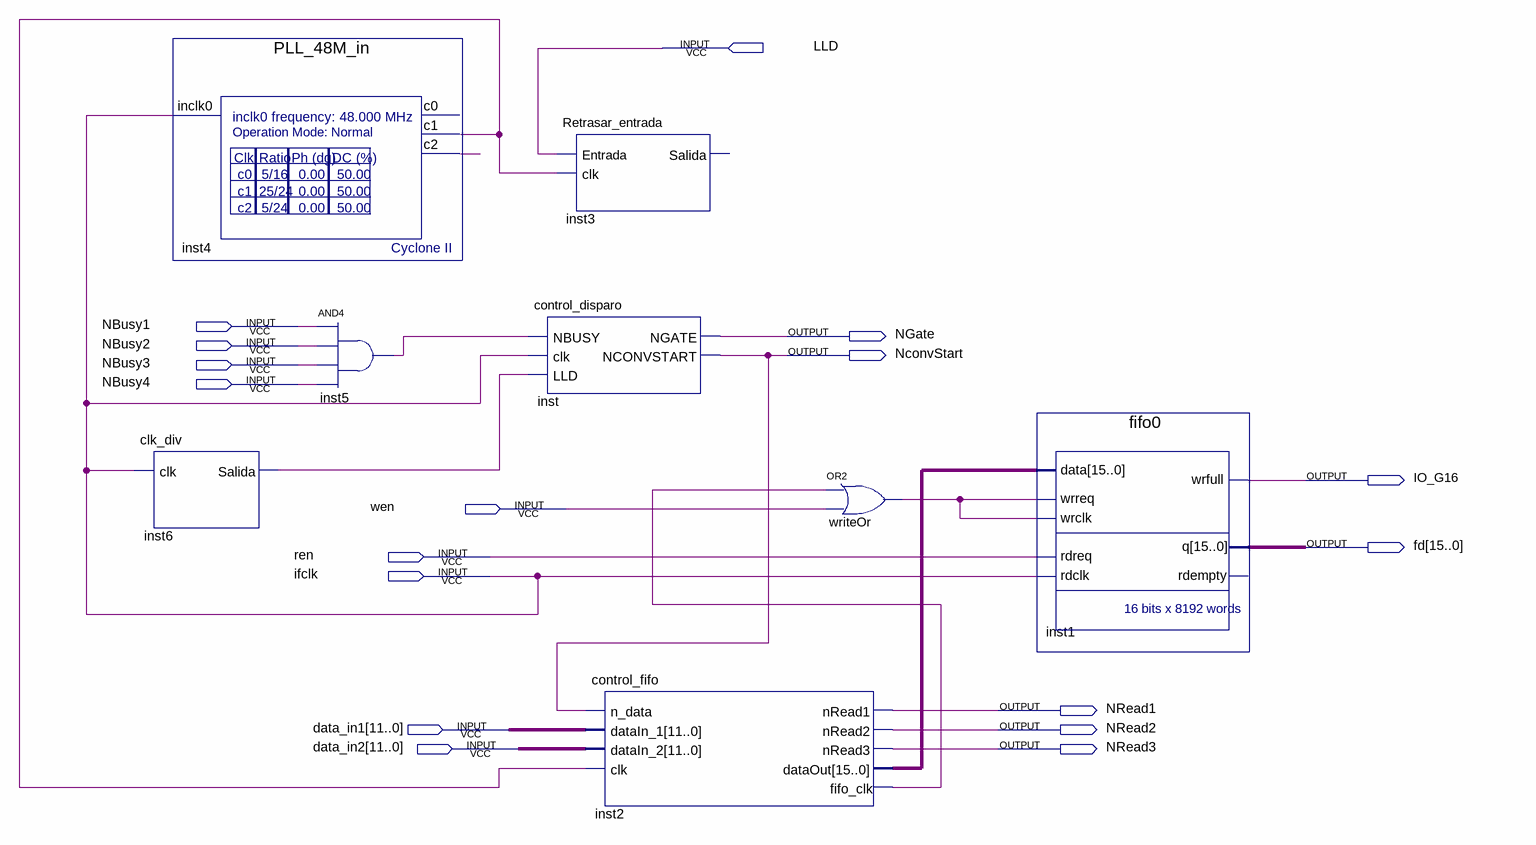
[diagram p0: schematic sheet]
// Quartus schematic Template.bdf as structural Verilog: 8 symbols, 17 pins
module Template (
  input  LLD,
  input  NBusy1,
  input  NBusy2,
  input  NBusy3,
  input  NBusy4,
  input  wen,
  input  ren,
  input  ifclk,
  input  [11:0] data_in1,
  input  [11:0] data_in2,
  output NGate,
  output NconvStart,
  output IO_G16,
  output [15:0] fd,
  output NRead1,
  output NRead2,
  output NRead3
);

  wire inst2_fifo_clk, inst4_c1, inst4_c2, inst5_out, inst6_salida, writeOr_out;
  wire [15:0] inst2_dataout;

  PLL_48M_in inst4 (.inclk0(ifclk), .c1(inst4_c1), .c2(inst4_c2));  // open: c0
  clk_div inst6 (.clk(ifclk), .Salida(inst6_salida));
  and inst5 (inst5_out, NBusy1, NBusy2, NBusy3, NBusy4);
  Retrasar_entrada inst3 (.Entrada(LLD), .clk(inst4_c1));  // open: Salida
  control_disparo inst (.NBUSY(inst5_out), .clk(ifclk), .LLD(inst6_salida), .NGATE(NGate), .NCONVSTART(NconvStart));
  control_fifo inst2 (
    .n_data(NconvStart), .dataIn_1(data_in1), .dataIn_2(data_in2), .clk(inst4_c1), .nRead1(NRead1),
    .nRead2(NRead2), .nRead3(NRead3), .dataOut(inst2_dataout), .fifo_clk(inst2_fifo_clk));
  or writeOr (writeOr_out, inst2_fifo_clk, wen);
  fifo0 inst1 (
    .data(inst2_dataout), .wrreq(writeOr_out), .wrclk(writeOr_out), .rdreq(ren), .rdclk(ifclk),
    .wrfull(IO_G16), .q(fd));  // open: rdempty
endmodule
